# Altium schematic sheet Power.SchDoc: Board-On-Chip Power Supply
size A4; Organization: Altium Limited; Address1: L3, 12a Rodborough Rd; Address2: Frenchs Forest; Address3: NSW; Address4: Australia 2086; DocumentNumber: 3; Revision: 1.05; SheetNumber: 3; SheetTotal: 7
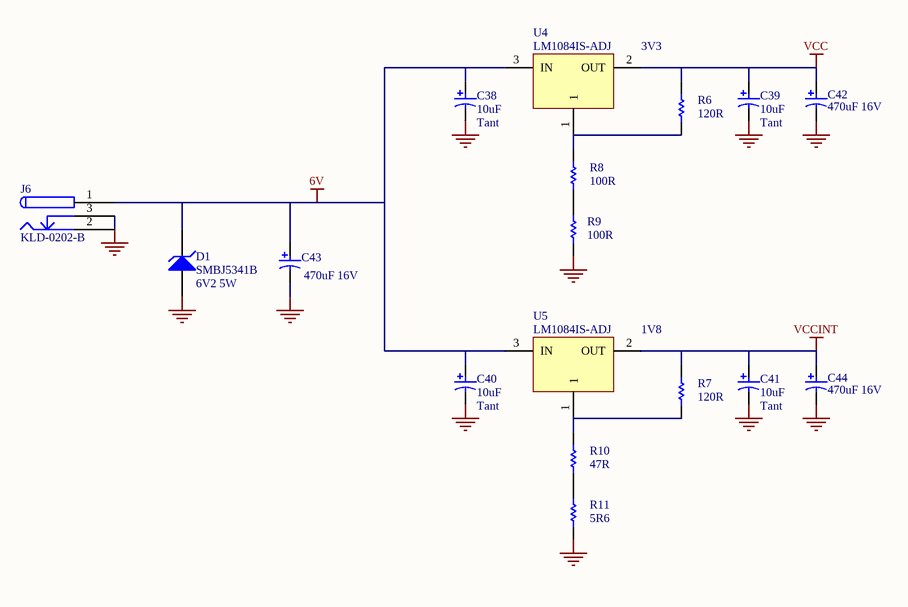
[diagram p0: Power.SchDoc]

## Parts
C38  10uF  Capacitor Type: Tant  [MCCT-B]
C39  10uF  Capacitor Type: Tant  [MCCT-B]
C40  10uF  Capacitor Type: Tant  [MCCT-B]
C41  10uF  Capacitor Type: Tant  [MCCT-B]
C42  470uF 16V  [RB8/3.5]
C43  470uF 16V  [RB8/3.5]
C44  470uF 16V  [RB8/3.5]
D1  SMBJ5341B  Part Description: 6V2 5W  [DO214]
J6  KLD-0202-B  [KLD-0202]
R6  120R  [CC2012-0805]
R7  120R  [CC2012-0805]
R8  100R  [CC2012-0805]
R9  100R  [CC2012-0805]
R10  47R  [CC2012-0805]
R11  5R6  [CC2012-0805]
U4  LM1084IS-ADJ  [TO-263]
U5  LM1084IS-ADJ  [TO-263]

## Nets
6V: C38.1 C40.1 C43.1 D1.2(K) J6.1 J6.1A J6.1B U4.3(IN) U5.3(IN)
GND: C38.2 C39.2 C40.2 C41.2 C42.2 C43.2 C44.2 D1.1(A) J6.2 J6.2A J6.2B J6.3 J6.3A J6.3B R9.1 R11.2
VCC: C39.1 C42.1 R6.1 U4.2(OUT)
VCCINT: C41.1 C44.1 R7.1 U5.2(OUT)
NetR6_2: R6.2 R8.1 U4.1
NetR7_2: R7.2 R10.1 U5.1
NetR8_2: R8.2 R9.2
NetR10_2: R10.2 R11.1

## Notes on the sheet
- 3V3
- 1V8
- Title
- Size:
- Date:
- A
- Number:
- Time:
- Revision:
- Sheet
- of
- File:

## Library data of the parts
C38-C44 = CAP_POLAR: Polar Capacitor; Fitted: True
D1 = BZG03C13: Zener Diode, 6.2V, 5W; Manufacturer: Microsemi; Fitted: True; Revision: 31-Oct-2003
J6 = KLD-0202-B: Low Voltage Power Supply Connector; Manufacturer: Kycon; Fitted: True
R6-R11 = RES: Resistor; Fitted: True
U4 U5 = LM1084IS-ADJ: 5A Low Dropout Possitive Regulators; Fitted: True